# EasyEDA schematic SCH_Hackaton_2023-12-24.json
TITLE: Sheet_1; REV: 1.0; Date: 2023-12-24; Sheet: 1/1; Drawn By: basgoossens; Company: Your Company
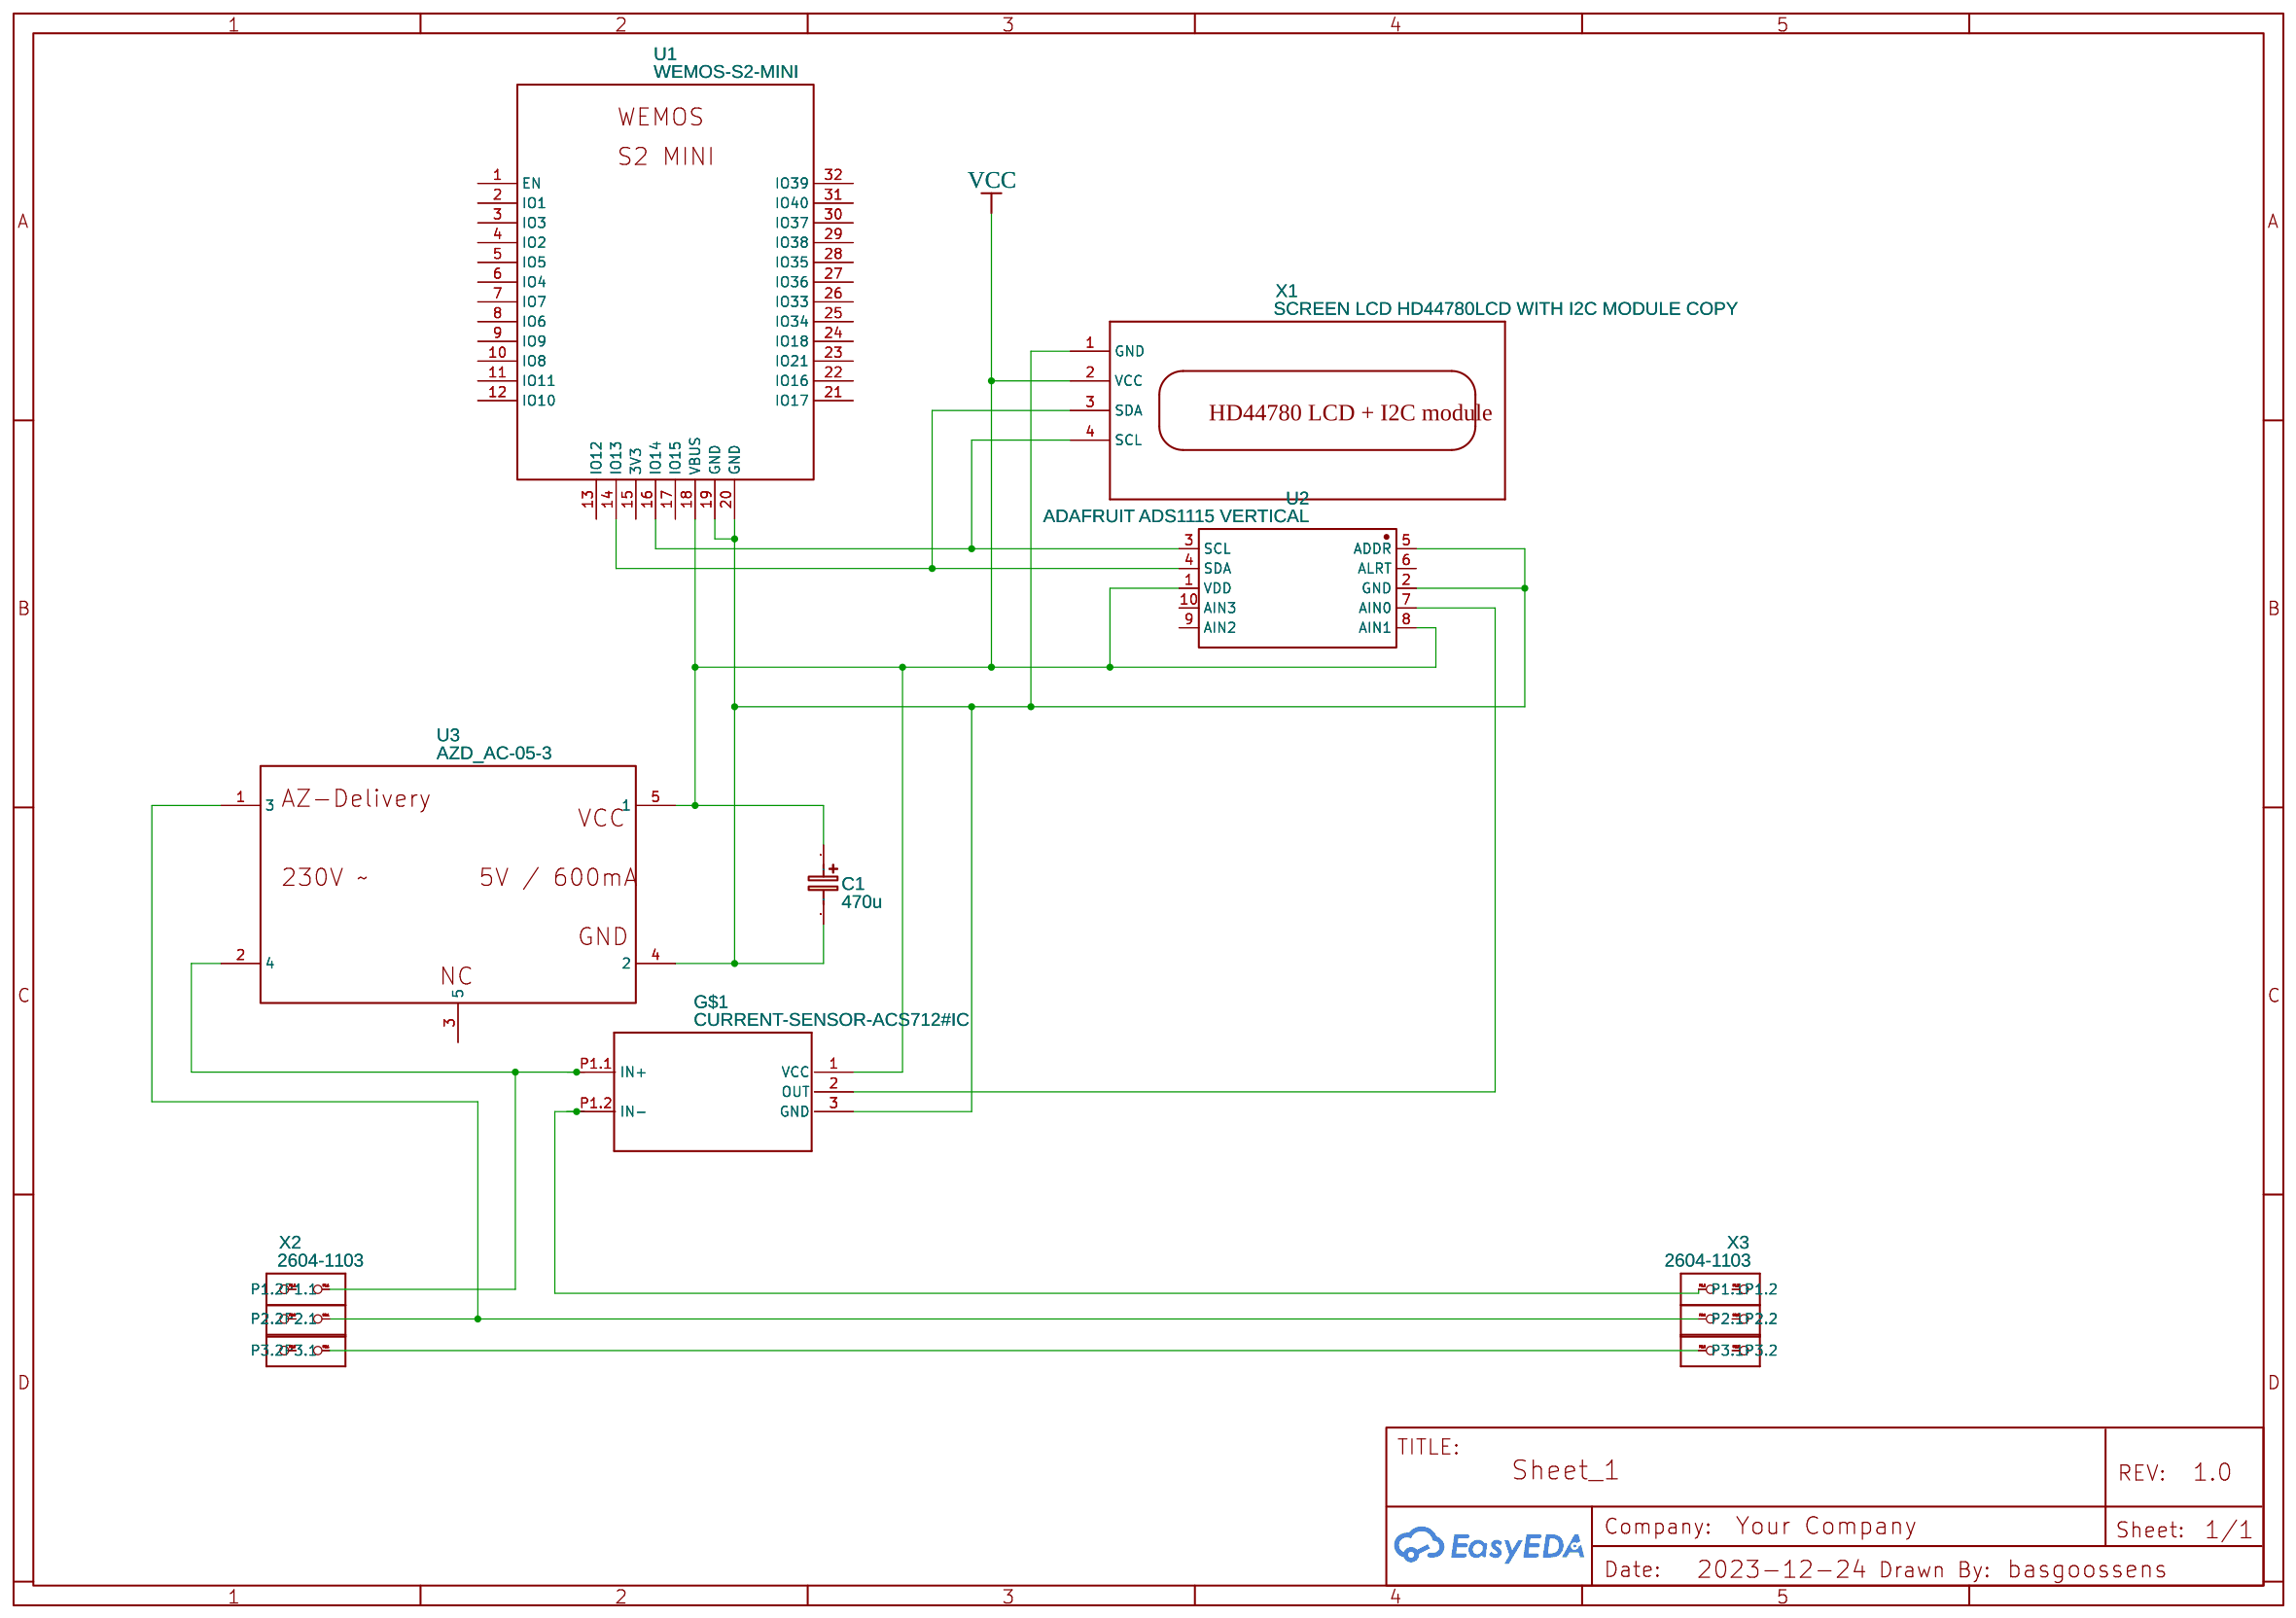
[diagram p0: schematic sheet]

## Parts
C1  470u  [CAP-D8.0×F3.5]
G$1  CURRENT-SENSOR-ACS712#IC  [CURRENT-SENSOR-ACS712#IC]
U1  WEMOS-S2-MINI  [WEMOS-S2-MINI]
U2  ADAFRUIT ADS1115 VERTICAL  [ADS1115_ADAFRUIT_VERTICAL]
U3  AZD_AC-05-3  [FT_AC-05-3]
X1  SCREEN LCD HD44780LCD WITH I2C MODULE COPY  [I2C LCD1602 I2C PCF8574AT]
X2  2604-1103  [P-2604-1103]
X3  2604-1103  [P-2604-1103]

## Library data of the parts
C1 = CE_TH_D8.0×F3.5_EU: Contributor: LCEDA_Lib
G$1 = CURRENT-SENSOR-ACS712#IC: Contributor: pmkorp
U1 = WEMOS-S2-MINI: Manufacturer: WEMOS; Manufacturer Part: Wemos; Supplier: WEMOS; Supplier Part: WEMOS_S2_MINI; link: https://www.wemos.cc/en/latest/s2/s2_mini.html?spm=a2g0o.detail.1000023.1.36da1596ZoDwKF; Contributor: suppawoot
U2 = ADAFRUIT ADS1115 VERTICAL: Manufacturer: Texas Instruments; Manufacturer Part: ADS1115; Supplier: Adafruit; Supplier Part: 1085; link: https://www.adafruit.com/product/1085; Contributor: joshgarde
U3 = AZD_AC-05-3: Manufacturer: AZ-Delivery; Manufacturer Part: AC-05-3; Supplier Part: AZ-Delivery; Contributor: marcelobook
X1 = SCREEN LCD HD44780LCD WITH I2C MODULE COPY: Contributor: yucspcb
X2 X3 = 2604-1103: Contributor: patrick.lermer06

## Nets
VCC: C1.1 G$1.1(VCC) U1.18(VBUS) U2.1(VDD) U2.8(AIN1) U3.5(1) X1.2(VCC)
Net-(C1-2): C1.2 G$1.3(GND) U1.19(GND) U1.20(GND) U2.2(GND) U2.5(ADDR) U3.4(2) X1.1(GND)
Net-(G$1-2): G$1.2(OUT) U2.7(AIN0)
Net-(G$1-P1.1): G$1.P1.1(IN+) U3.2(4) X2.P1.1
Net-(G$1-P1.2): G$1.P1.2(IN-) X3.P1.1
Net-(U1-14): U1.14(IO13) U2.4(SDA) X1.3(SDA)
Net-(U1-16): U1.16(IO14) U2.3(SCL) X1.4(SCL)
Net-(U3-1): U3.1(3) X2.P2.1 X3.P2.1
Net-(X2-P3.1): X2.P3.1 X3.P3.1

Not connected (* = marked no-connect by the designer): U1 1(EN) 2(IO1) 3(IO3) 4(IO2) 5(IO5) 6(IO4) 7(IO7) 8(IO6) 9(IO9) 10(IO8) 11(IO11) 12(IO10) 13(IO12) 15(3V3) 17(IO15) 21(IO17) 22(IO16) 23(IO21) 24(IO18) 25(IO34) 26(IO33) 27(IO36) 28(IO35) 29(IO38) 30(IO37) 31(IO40) 32(IO39); U2 6(ALRT) 9(AIN2) 10(AIN3); U3 3(5); X2 P1.2 P2.2 P3.2; X3 P1.2 P2.2 P3.2
